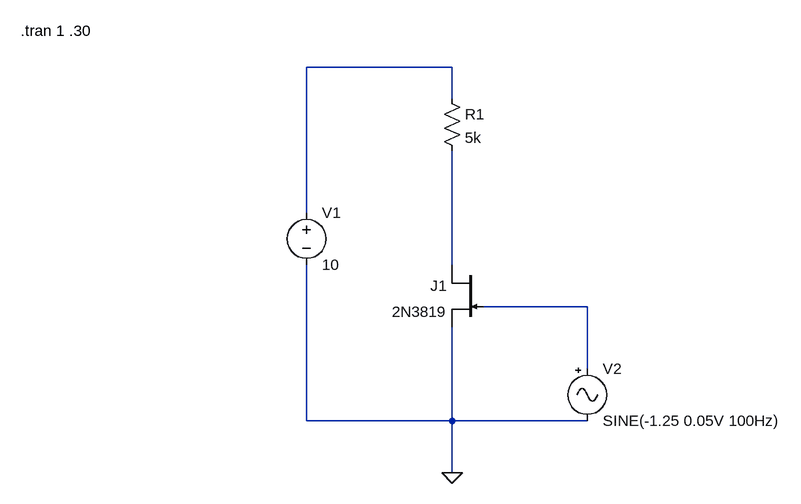
[diagram p0: schematic Draft4.asc]
Draft4.asc, the LTspice schematic file:
Version 4
SHEET 1 880 720
WIRE 96 80 -128 80
WIRE 96 128 96 80
WIRE -128 304 -128 80
WIRE 96 384 96 208
WIRE 304 448 144 448
WIRE 304 544 304 448
WIRE -128 624 -128 384
WIRE 96 624 96 480
WIRE 96 624 -128 624
WIRE 304 624 96 624
WIRE 96 704 96 624
FLAG 96 704 0
SYMBOL voltage -128 288 R0
SYMATTR InstName V1
SYMATTR Value 10
SYMBOL res 80 112 R0
SYMATTR InstName R1
SYMATTR Value 5k
SYMBOL njf 144 384 M0
SYMATTR InstName J1
SYMATTR Value 2N3819
SYMBOL signal 304 528 R0
SYMATTR InstName V2
SYMATTR Value SINE(-1.25 0.05V 100Hz)
SYMATTR Value2 AC 0.05V
TEXT -568 24 Left 2 !.tran 1 .30

The netlist it stands for:
* Draft4.asc
V1 N001 0 10
R1 N001 N002 5k
J1 N002 N003 0 2N3819
V2 N003 0 SINE(-1.25 0.05V 100Hz) AC 0.05V
.model NJF NJF
.model PJF PJF
.lib standard.jft
.tran 1 .30
.backanno
.end